# Altium project GanInverter.PrjPCB (part 2 of 3)

## Sheet Phase_Measurements.SchDoc
size A4; Author: K. Ilhan; CompanyName: Technische Hochschule Nürnberg Georg Simon Ohm; Organization: UltraZohm; Address1: Kesslerplatz 12; Address2: 90489 Nürnberg; Address3: GERMANY; SheetNumber: 6; SheetTotal: 8; Website: www.ultrazohm.com
Used 3 times, as channels PhaseMeasurements1, PhaseMeasurements2, PhaseMeasurements3. Parts and nets are listed once, with the designators drawn on the sheet.
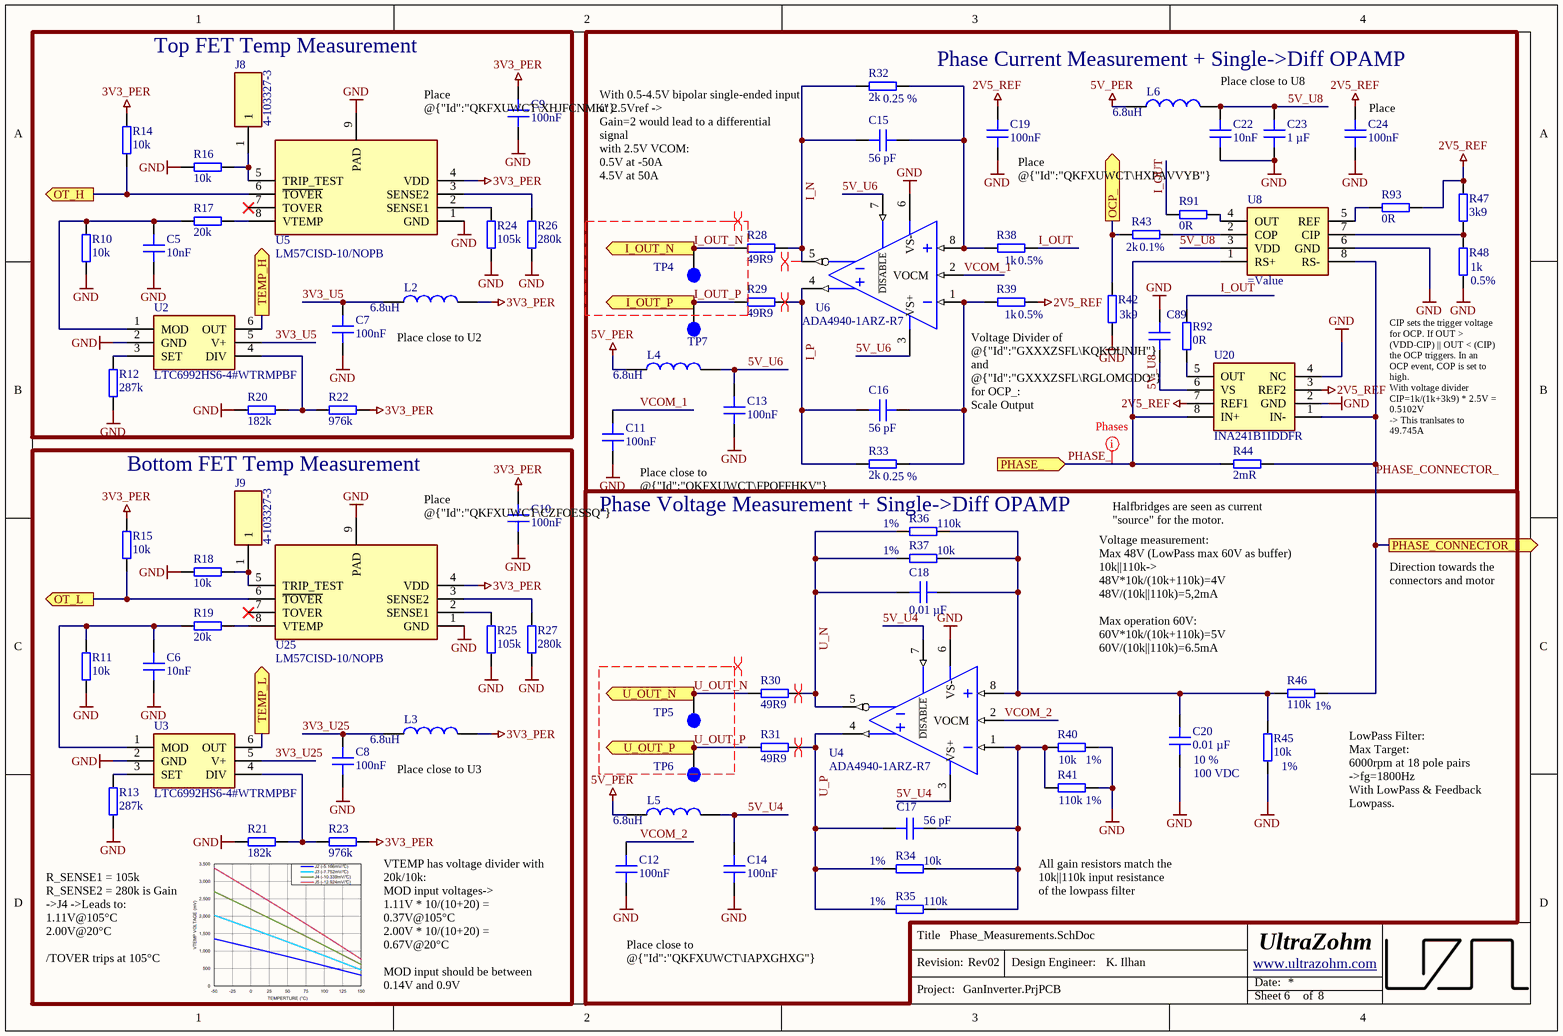
[diagram p4: Phase_Measurements.SchDoc]

### Parts
C5  10nF  [C_0603]
C6  10nF  [C_0603]
C7  100nF  [C_0603]
C8  100nF  [C_0603]
C9  100nF  [C_0603]
C10  100nF  [C_0603]
C11  100nF  [C_0603]
C12  100nF  [C_0603]
C13  100nF  [C_0603]
C14  100nF  [C_0603]
C15  56 pF  [C_0603]
C16  56 pF  [C_0603]
C17  56 pF  [C_0603]
C18  0.01 µF  [C_0603]
C19  100nF  [C_0603]
C20  0.01 µF  Tolerance: 10 %  Voltage Rating: 100 VDC  [C_0805]
C22  10nF  [C_0603]
C23  1 µF  [C_0603]
C24  100nF  [C_0603]
C89  100 nF  [C_0603]  (value not drawn)
J8  4-103327-3  [1_Pin_Header]
J9  4-103327-3  [1_Pin_Header]
L2  6.8uH  [INDC1608X95N]
L3  6.8uH  [INDC1608X95N]
L4  6.8uH  [INDC1608X95N]
L5  6.8uH  [INDC1608X95N]
L6  6.8uH  [INDC1608X95N]
R10  10k  [RES 0603_1608]
R11  10k  [RES 0603_1608]
R12  287k  [RES 0805_2012]
R13  287k  [RES 0805_2012]
R14  10k  [RES 0603_1608]
R15  10k  [RES 0603_1608]
R16  10k  [RES 0603_1608]
R17  20k  [RES 0603_1608]
R18  10k  [RES 0603_1608]
R19  20k  [RES 0603_1608]
R20  182k  [RES 0603_1608]
R21  182k  [RES 0603_1608]
R22  976k  [RES 0603_1608]
R23  976k  [RES 0603_1608]
R24  105k  [RES 0603_1608]
R25  105k  [RES 0603_1608]
R26  280k  [RES 0603_1608]
R27  280k  [RES 0603_1608]
R28  49R9  [RES 0603_1608]
R29  49R9  [RES 0603_1608]
R30  49R9  [RES 0603_1608]
R31  49R9  [RES 0603_1608]
R32  2k  Tolerance: 0.25 %  [RES 0603_1608]
R33  2k  Tolerance: 0.25 %  [RES 0603_1608]
R34  10k  Tolerance: 1%  [RES 0603_1608]
R35  110k  Tolerance: 1%  [RES 0603_1608]
R36  110k  Tolerance: 1%  [RES 0603_1608]
R37  10k  Tolerance: 1%  [RES 0603_1608]
R38  1k  Tolerance: 0.5%  [RES 0603_1608]
R39  1k  Tolerance: 0.5%  [RES 0603_1608]
R40  10k  Tolerance: 1%  [RES 0603_1608]
R41  110k  Tolerance: 1%  [RES 0603_1608]
R42  3k9  [RES 0603_1608]
R43  2k  Tolerance: 0.1%  [RES 0603_1608]
R44  2mR  [3921]
R45  10k  Tolerance: 1%  [RES 0603_1608]
R46  110k  Tolerance: 1%  [RES 0603_1608]
R47  3k9  [RES 0603_1608]
R48  1k  Tolerance: 0.5%  [RES 0603_1608]
R91  0R  [RES 0603_1608]
R92  0R  [RES 0603_1608]
R93  0R  [RES 0603_1608]
TP4  Testpoint 1mm  [TP_1mm]  (value not drawn)  (no BOM)
TP5  Testpoint 1mm  [TP_1mm]  (value not drawn)  (no BOM)
TP6  Testpoint 1mm  [TP_1mm]  (value not drawn)  (no BOM)
TP7  Testpoint 1mm  [TP_1mm]  (value not drawn)  (no BOM)
U2  LTC6992HS6-4#WTRMPBF  [SOT95P280X100-6N]
U3  LTC6992HS6-4#WTRMPBF  [SOT95P280X100-6N]
U4  ADA4940-1ARZ-R7  [SOT127P600X175-8N]
U5  LM57CISD-10/NOPB  [SON50P250X250X80-9N]
U6  ADA4940-1ARZ-R7  [SOT127P600X175-8N]
U8  (no value)  [SOP65P490X110-8N]
U20  INA241B1IDDFR  [SOT65P280X110-8N]
U25  LM57CISD-10/NOPB  [SON50P250X250X80-9N]

### Blocks framed on the sheet
Top FET Temp Measurement: C5 C7 C9 J8 L2 R10 R12 R14 R16 R17 R20 R22 R24 R26 U2 U5
Phase Current Measurement + Single->Diff OPAMP: C11 C13 C15 C16 C19 C22-C24 C89 L4 L6 R28 R29 R32 R33 R38 R39 R42-R44 R47 R48 R91-R93 TP4 TP7 U6 U8 U20
Bottom FET Temp Measurement: C6 C8 C10 J9 L3 R11 R13 R15 R18 R19 R21 R23 R25 R27 U3 U25
Phase Voltage Measurement + Single->Diff OPAMP: C12 C14 C17 C18 C20 L5 R30 R31 R34-R37 R40 R41 R45 R46 TP5 TP6 U4

### Ports
I_OUT_N (out), I_OUT_P (out), OCP_ (out), OT_H (out), OT_L (out), PHASE_ (in), PHASE_CONNECTOR_ (out), TEMP_H (out), TEMP_L (out), U_OUT_N (out), U_OUT_P (out)

### Nets
2V5_REF: C19.1 C24.1 R39.2 R47.2 R93.2 U20.3(REF2) U20.7(REF1)
3V3_PER: C9.1 C10.1 L2.2 L3.2 R14.1 R15.1 R22.2 R23.2 U5.4(VDD) U25.4(VDD)
5V_PER: L4.1 L5.1 L6.1
GND: C5.1 C6.1 C7.1 C8.1 C9.2 C10.2 C11.1 C12.1 C13.1 C14.1 C19.2 C20.1 C22.1 C23.1 C24.2 C89.1 R10.2 R11.2 R12.1 R13.1 R16.2 R18.2 R20.1 R21.1 R24.1 R25.1 R26.1 R27.1 R40.1 R41.2 R42.2 R45.1 R48.1 U2.2(GND) U3.2(GND) U4.6(VS-) U5.1(GND) U5.9(PAD) U6.6(VS-) U8.6(GND) U20.2(GND) U20.4(NC) U25.1(GND) U25.9(PAD)
3V3_U5: C7.2 L2.1 U2.5(V+)
3V3_U25: C8.2 L3.1 U3.5(V+)
5V_U4: C14.2 L5.2 U4.3(VS+) U4.7(~{DISABLE})
5V_U6: C13.2 L4.2 U6.3(VS+) U6.7(~{DISABLE})
5V_U8: C22.2 C23.2 C89.2 L6.2 U8.3(VDD) U20.6(VS)
I_N: C15.1 R28.2 R32.1 U6.5(VOUT-)
I_OUT: R38.2 R91.1 R92.2
I_OUT_N: R28.1 TP4.1 ; port I_OUT_N
I_OUT_P: R29.1 TP7.1 ; port I_OUT_P
I_P: C16.1 R29.2 R33.1 U6.4(VOUT+)
OCP_: R42.1 R43.1 ; port OCP_
OT_H: R14.2 U5.6(~{TOVER}) ; port OT_H
OT_L: R15.2 U25.6(~{TOVER}) ; port OT_L
PHASE_: R44.1 U8.1(RS+) U20.8(IN+) ; port PHASE_
PHASE_CONNECTOR_: R44.2 R46.2 U8.8(RS-) U20.1(IN-) ; port PHASE_CONNECTOR_
TEMP_H: U2.6(OUT) ; port TEMP_H
TEMP_L: U3.6(OUT) ; port TEMP_L
U_N: C18.1 R30.2 R36.1 R37.2 U4.5(VOUT-)
U_OUT_N: R30.1 TP5.1 ; port U_OUT_N
U_OUT_P: R31.1 TP6.1 ; port U_OUT_P
U_P: C17.1 R31.2 R34.2 R35.1 U4.4(VOUT+)
VCOM_1: C11.2 U6.2(VOCM)
VCOM_2: C12.2 U4.2(VOCM)
NetC5_2: C5.2 R10.1 R17.1 U2.1(MOD)
NetC6_2: C6.2 R11.1 R19.1 U3.1(MOD)
NetC15_2: C15.2 R32.2 R38.1 U6.8(VIN+)
NetC16_2: C16.2 R33.2 R39.1 U6.1(VIN-)
NetC17_2: C17.2 R34.1 R35.2 R40.2 R41.1 U4.1(VIN-)
NetC18_2: C18.2 C20.2 R36.2 R37.1 R45.2 R46.1 U4.8(VIN+)
NetJ8_1: J8.1 R16.1 U5.5(TRIP_TEST)
NetJ9_1: J9.1 R18.1 U25.5(TRIP_TEST)
NetR12_2: R12.2 U2.3(SET)
NetR13_2: R13.2 U3.3(SET)
NetR17_2: R17.2 U5.8(VTEMP)
NetR19_2: R19.2 U25.8(VTEMP)
NetR20_2: R20.2 R22.1 U2.4(DIV)
NetR21_2: R21.2 R23.1 U3.4(DIV)
NetR24_2: R24.2 U5.2(SENSE1)
NetR25_2: R25.2 U25.2(SENSE1)
NetR26_2: R26.2 U5.3(SENSE2)
NetR27_2: R27.2 U25.3(SENSE2)
NetR43_2: R43.2 U8.2(COP)
NetR47_1: R47.1 R48.2 U8.7(CIP)
NetR91_2: R91.2 U8.4(OUT)
NetR92_1: R92.1 U20.5(OUT)
NetR93_1: R93.1 U8.5(REF)

Not connected (* = marked no-connect by the designer): U5 7(TOVER)*; U25 7(TOVER)*

### Channels
PhaseMeasurements1: designators end in A; ports I_OUT_N=I_OUT_N I_OUT_P=I_OUT_P OCP_=OC_1 OT_H=OT_H1 OT_L=OT_L1 PHASE_=COM_HS PHASE_CONNECTOR_=PHASE_CONNECTOR_ TEMP_H=TEMP_H1 TEMP_L=TEMP_L1 U_OUT_N=U_OUT_N U_OUT_P=U_OUT_P
PhaseMeasurements2: designators end in B; ports I_OUT_N=I_OUT_N I_OUT_P=I_OUT_P OCP_=OC_2 OT_H=OT_H2 OT_L=OT_L2 PHASE_=COM_HS PHASE_CONNECTOR_=PHASE_CONNECTOR_ TEMP_H=TEMP_H2 TEMP_L=TEMP_L2 U_OUT_N=U_OUT_N U_OUT_P=U_OUT_P
PhaseMeasurements3: designators end in C; ports I_OUT_N=I_OUT_N I_OUT_P=I_OUT_P OCP_=OC_3 OT_H=OT_H3 OT_L=OT_L3 PHASE_=COM_HS PHASE_CONNECTOR_=PHASE_CONNECTOR_ TEMP_H=TEMP_H3 TEMP_L=TEMP_L3 U_OUT_N=U_OUT_N U_OUT_P=U_OUT_P

### Layout directives
differential pair: I_N_PhaseMeasurements1, I_OUT_N, I_OUT_P, I_P_PhaseMeasurements1, U_N_PhaseMeasurements1, U_OUT_N, U_OUT_P, U_P_PhaseMeasurements1
net class Power: COM_HS

### Notes on the sheet
- Place @{"Id":"QKFXUWCT\XHJFCNMK"} close to U5
- Place close to U8
- (near C24) Place @{"Id":"QKFXUWCT\MQDZIENV"} close to U8
- With 0.5-4.5V bipolar single-ended input at 2.5Vref ->
  Gain=2 would lead to a differential signal
  with 2.5V VCOM:
  0.5V at -50A
  4.5V at 50A
- (near C19) Place @{"Id":"QKFXUWCT\HXPAVVYB"} close to @{"Id":"QKFXUWCT\EZPYTFWS"}
- (near L2) Place close to U2
- Voltage Divider of @{"Id":"GXXXZSFL\KQKOUNJH"} and @{"Id":"GXXXZSFL\RGLOMGDO"} for OCP_:
  Scale Output
  5V -> 3V3
  (5V*3k9)/3k9+2k)
  -> 3.31V
- Place @{"Id":"QKFXUWCT\CZFOESSQ"} close to @{"Id":"QKFXUWCT\SWIXKLSF"}
- Place close to @{"Id":"QKFXUWCT\FPQFFHKV"} OPAMP
- (near R44) Halfbridges are seen as current "source" for the motor.
- (near R48) CIP sets the trigger voltage for OCP. If OUT > (VDD-CIP) || OUT < (CIP) the OCP triggers. In an OCP event, COP is set to high.
  With voltage divider CIP=1k/(1k+3k9) * 2.5V = 0.5102V
  -> This tranlsates to 49.745A
- (near R46) Voltage measurement:
  Max 48V (LowPass max 60V as buffer)
  10k||110k->
  48V*10k/(10k+110k)=4V
  48V/(10k||110k)=5,2mA
  Max operation 60V:
  60V*10k/(10k+110k)=5V
  60V/(10k||110k)=6.5mA
- Direction towards the connectors and motor
- (near L3) Place close to U3
- (near R46) LowPass Filter:
  Max Target:
  6000rpm at 18 pole pairs
  ->fg=1800Hz
  With LowPass & Feedback Lowpass.
- All gain resistors match the 10k||110k input resistance of the lowpass filter
- R_SENSE1 = 105k
  R_SENSE2 = 280k is Gain
  ->J4 ->Leads to:
  1.11V@105°C
  2.00V@20°C
  /TOVER trips at 105°C
- (near R23) VTEMP has voltage divider with 20k/10k:
  MOD input voltages->
  1.11V * 10/(10+20) = 0.37V@105°C
  2.00V * 10/(10+20) = 0.67V@20°C
  MOD input should be between 0.14V and 0.9V
- Place close to @{"Id":"QKFXUWCT\IAPXGHXG"} OPAMP
- Title
- Revision:
- Design Engineer:
- Date:
- Project:
- Sheet
- of

### Library data of the parts
C5 C6 C22 = CT41G-0603-2X1-50V-0.01μF-K(N): 50V 10nF 2X1 ±10%; Manufacturer: TORCH; Voltage Rating: 50 VDC; Created from: KIlhan; Manufacturer Part Number: CT41G-0603-2X1-50V-0.01μF-K(N); PartID: 130; Created On: 7/5/2023 6:57:50 PM; ComponentLink1Description: Datasheet; ComponentLink1URL: https://datasheet.lcsc.com/lcsc/1809291621_TORCH-CT41G-0603-2X1-50V-0-01-F-K-N_C136131.pdf; Component Type: Capacitor 0603; Device Package: 0603; Last Updated: 7/5/2023 6:57:50 PM; Mounting Type: SMD; Operating Temperature: -55 - 125°C; Supplier 1: LCSC; Supplier Part Number 1: C136131; Type: Capacitor; Tolerance: 10 %; Value: 10nF; Live Cycle Status: 1; Stock number: not stored; LCSC Part Number: C136131
C7-C14 C19 C24 = CGA3E3X8R1H104KT0Y0N: 50V 100nF X8R ±10% 0603; Manufacturer: TDK; Voltage Rating: 50 VDC; Created from: KIlhan; Manufacturer Part Number: CGA3E3X8R1H104KT0Y0N; PartID: 131; Created On: 7/5/2023 7:32:58 PM; ComponentLink1Description: Datasheet; ComponentLink1URL: https://datasheet.lcsc.com/lcsc/2304140030_TDK-CGA3E3X8R1H104KT0Y0N_C342825.pdf; Component Type: Capacitor 0603; Device Package: 0603; Last Updated: 7/5/2023 7:32:58 PM; Mounting Type: SMD; Operating Temperature: -55 - 125°C; Series: CGA; Supplier 1: LCSC; Supplier Part Number 1: C342825; Type: Capacitor; Tolerance: 10 %; Value: 100nF; Live Cycle Status: 1; Stock number: not stored; LCSC Part Number: C342825
C15-C17 = CL10C560JB8NNNC: Capacitor 0603, 50 VDC, 56 pF, C0G; Manufacturer: Samsung Electro-Mechanics; Tolerance: 5 %; Voltage Rating: 50 VDC; Created from: DHufnagel; Manufacturer Part Number: CL10C560JB8NNNC; PartID: 92; Created On: 12/20/2020 1:54:13 PM; ComponentLink1Description: Datasheet; ComponentLink1URL: https://www.mouser.de/datasheet/2/585/MLCC-1837944.pdf; Component Type: Capacitor 0603; Device Package: 0603; Last Updated: 12/20/2020 4:24:16 PM; Mounting Type: SMD; Operating Temperature: -55 - 125°C; Series: CL; Supplier 1: Mouser; Supplier Part Number 1: 187-CL10C560JB8NNNC; Supplier 2: LCSC; Supplier Part Number 2: C39148; Type: Capacitor; Value: 56 pF; Live Cycle Status: 1; LCSC Part Number: C39148; Stock number: not stored
C18 = C1608C0G1E103JT000N: 25V 10nF C0G ±5% 0603 Multilayer Ceramic Capacitors MLCC - SMD/SMT ROHS; Manufacturer: TDK; Voltage Rating: 25 VDC; Created from: KIlhan; Manufacturer Part Number: C1608C0G1E103JT000N; PartID: 127; Created On: 7/5/2023 3:26:52 PM; ComponentLink1Description: Datasheet; ComponentLink1URL: https://product.tdk.com/system/files/dam/doc/product/capacitor/ceramic/mlcc/catalog/mlcc_commercial_general_en.pdf; Component Type: Capacitor 0603; Device Package: 0603; Last Updated: 7/5/2023 3:26:52 PM; Mounting Type: SMD; Operating Temperature: -55 - 125°C; Series: C; Supplier 1: Mouser; Supplier Part Number 1: 810-C1608C0G1E103J; Type: Capacitor; Tolerance: 5 %; Value: 0.01 µF; Live Cycle Status: 1; Stock number: not stored; LCSC Part Number: C343007
C20 = HV0805X7R103K101NT: 100V 10nF 0805 Multilayer Ceramic Capacitors MLCC - SMD/SMT ROHS; Manufacturer: AIDE; Created from: KIlhan; Manufacturer Part Number: HV0805X7R103K101NT; PartID: 128; Created On: 7/5/2023 3:42:28 PM; ComponentLink1Description: Datasheet; ComponentLink1URL: https://datasheet.lcsc.com/lcsc/2103311437_AIDE-HV1210X7R332K202NT_C2691813.pdf; Component Type: Capacitor 0805; Device Package: 0805; Last Updated: 7/5/2023 3:42:28 PM; Mounting Type: SMD; Operating Temperature: -55 - 125°C; Series: C; Supplier 1: JLCPCB; Supplier Part Number 1: HV0805X7R103K101NT; Type: Capacitor; Value: 0.01 µF; Live Cycle Status: 1; Stock number: not stored; LCSC Part Number: C2691724
C23 = UMK107AB7105KA-T: 50V 1uF X7R ±10% 0603 Multilayer Ceramic Capacitors MLCC - SMD/SMT ROHS; Manufacturer: Taiyo Yuden; Voltage Rating: 50 VDC; Created from: NDiringer; Manufacturer Part Number: UMK107AB7105KA-T; PartID: 98; Created On: 8/9/2022 9:35:02 AM; ComponentLink1Description: Datasheet; ComponentLink1URL: https://www.mouser.de/datasheet/2/396/mlcc02_e-1307760.pdf; Component Type: Capacitor 0603; Device Package: 0603; Last Updated: 9/21/2022 4:11:37 PM; Mounting Type: SMD; Operating Temperature: -55 - 125°C; Series: X7R; Type: Capacitor; Tolerance: 10 %; Value: 1 µF; Live Cycle Status: 1; Stock number: not stored; LCSC Part Number: C105174; Supplier 1: LCSC; Supplier Part Number 1: C105174; Supplier 2: Mouser; Supplier Part Number 2: 963-UMK107AB7105MA-T
C89 = CC0603KRX7R9BB104: Capacitor 0603, 50 VDC, 100 nF, X7R; Manufacturer: YAGEO; Tolerance: 10 %; Voltage Rating: 50 VDC; Created from: AGeiger; Manufacturer Part Number: CC0603KRX7R9BB104; PartID: 102; Created On: 8/22/2022 2:35:53 PM; ComponentLink1Description: Datasheet; ComponentLink1URL: https://datasheet.lcsc.com/lcsc/1809301912_YAGEO-CC0603KRX7R9BB104_C14663.pdf; Component Type: Capacitor 0603; Device Package: 0603; Last Updated: 8/22/2022 2:35:53 PM; Mounting Type: SMD; Operating Temperature: -55 - 125°C; Series: X7R; Supplier 1: LCSC; Supplier Part Number 1: C14663; Type: Capacitor; Value: 100 nF; Live Cycle Status: 1; Supplier 2: Mouser; Supplier Part Number 2: 603-CC603KRX7R9BB104; LCSC Part Number: C14663
J8 J9 = 4-103327-3: Pin Header, 2.54mm, 1 Pin; Manufacturer: TE Connectivity; Created from: DHufnagel; Number of positions: 1; Manufacturer Part Number: 4-103327-3; PartID: 12; Created On: 8/18/2022 9:37:37 AM; ComponentLink1Description: Datasheet; ComponentLink1URL: https://www.mouser.de/datasheet/2/418/NG_CD_103327_T_baseFilename-749242.pdf; Component Type: Pin Header; Device Package: THT; Last Updated: 6/16/2023 12:29:10 PM; Mounting Type: THT; Operating Temperature: -65 - 105 °C; Series: AMPMODU MOD II; Supplier 1: Mouser; Supplier Part Number 1: 571-4-103327-3; Type: Pin Header; Live Cycle Status: 1; LCSC Part Number: C3347196; Stock number: not stored; Number of rows: 1
L2-L6 = CMCW1608F6R8KTT: 6.8uH ±10% 0603 Inductors (SMD) ROHS; Manufacturer: Cybermax; MF: EPCOS / TDK; DCR: 320m; Rated Current: 0.85 A; Type: fixed inductor; DC current: 15mA; Created from: KIlhan; MPN: B82464G4154M; Supplier 1: LCSC; Supplier Part Number 1: C961362; Value: 6.8uH; Manufacturer Part Number: CMCW1608F6R8KTT; PartID: 17; Created On: 7/5/2023 8:42:04 PM; ComponentLink1Description: Datasheet; ComponentLink1URL: https://jlcpcb.com/partdetail/Cybermax-CMCW1608F6R8KTT/C961362; Component Type: SMD fixed inductor; Device Package: SMD; Last Updated: 7/5/2023 8:42:04 PM; Mounting Type: SMD; Operating Temperature: -40 - 85 °C; Live Cycle Status: 1; Stock number: C961362; LCSC Part Number: C961362
R10 R11 R14-R16 R18 = RK73B1JTTD103J: SMD resistor E24 series; Manufacturer: KOA Speer; Tolerance: 5%; Created from: MGremer; Manufacturer Part Number: RK73B1JTTD103J; PartID: 98; Created On: 12/14/2020 4:17:14 PM; ComponentLink1Description: Datasheet; ComponentLink1URL: https://www.mouser.de/datasheet/2/219/RK73B-1825463.pdf; Component Type: SMD resistor; Device Package: 0603; Last Updated: 5/27/2022 2:04:22 PM; Mounting Type: SMD; Supplier 1: Mouser; Supplier Part Number 1: 660-RK73B1JTTD103J; Type: Resistor; Value: 10k; Live Cycle Status: 1; Stock number: Labor SMD Container; LCSC Part Number: C25804
R12 R13 = ERJ-6ENF2873V: SMD resistor 1%; Manufacturer: Panasonic; Created from: MGremer; Manufacturer Part Number: ERJ-6ENF2873V; PartID: 154; Created On: 12/14/2020 4:17:14 PM; ComponentLink1Description: Datasheet; ComponentLink1URL: https://www.mouser.de/datasheet/2/315/AOA0000C304-1149620.pdf; Component Type: SMD resistor; Device Package: 0805; Last Updated: 2/15/2023 6:07:29 PM; Mounting Type: SMD; Supplier 1: Mouser; Supplier Part Number 1: 667-ERJ-6ENF2873V; Type: Resistor; Tolerance: 1%; Value: 287k; Live Cycle Status: 1; Stock number: not stored; LCSC Part Number: C228683
R17 R19 = 0603WAF2002T5E: SMD resistor E24 series; Manufacturer: UNI-ROYAL; Tolerance: 1%; Created from: AGeiger; Manufacturer Part Number: 0603WAF2002T5E; PartID: 105; Created On: 12/14/2020 4:17:14 PM; ComponentLink1Description: Datasheet; ComponentLink1URL: https://datasheet.lcsc.com/lcsc/2206010230_UNI-ROYAL-Uniroyal-Elec-0603WAF2002T5E_C4184.pdf; Component Type: SMD resistor; Device Package: 0603; Last Updated: 8/25/2022 8:05:50 PM; Mounting Type: SMD; Supplier 1: LCSC; Supplier Part Number 1: C4184; Type: Resistor; Value: 20k; Live Cycle Status: 1; Stock number: Labor SMD Container; LCSC Part Number: C4184
R20 R21 = CR0603-FX-1823ELF: SMD resistor 1%, 50V, 100ppm; Manufacturer: Bourns; Created from: DHufnagel; Manufacturer Part Number: CR0603-FX-1823ELF; PartID: 235; Created On: 7/25/2022 8:26:35 AM; ComponentLink1Description: Datasheet; ComponentLink1URL: https://www.mouser.de/datasheet/2/54/cr-1858361.pdf; Component Type: SMD resistor; Device Package: 0603; Last Updated: 2/15/2023 6:09:14 PM; Mounting Type: SMD; Supplier 1: Mouser; Supplier Part Number 1: 652-CR0603FX-1823ELF; Type: Resistor; Tolerance: 1%; Value: 182k; Live Cycle Status: 1; Stock number: not stored; LCSC Part Number: C203368
R22 R23 = CR0603-FX-9763ELF: SMD resistor 1%, 50V, 100ppm; Manufacturer: Bourns; Created from: DHufnagel; Manufacturer Part Number: CR0603-FX-9763ELF; PartID: 234; Created On: 7/25/2022 8:26:35 AM; ComponentLink1Description: Datasheet; ComponentLink1URL: https://www.mouser.de/datasheet/2/54/cr-1858361.pdf; Component Type: SMD resistor; Device Package: 0603; Last Updated: 2/15/2023 6:14:05 PM; Mounting Type: SMD; Supplier 1: Mouser; Supplier Part Number 1: 652-CR0603FX-9763ELF; Type: Resistor; Tolerance: 1%; Value: 976k; Live Cycle Status: 1; Stock number: not stored; LCSC Part Number: C162980
R24 R25 = RC0603FR-07105KL: 100mW Thick Film Resistors ±100ppm/℃ ±1% 105kΩ 0603 Chip Resistor - Surface Mount ROHS; Manufacturer: YAGEO; Created from: KIlhan; Manufacturer Part Number: RC0603FR-07105KL; PartID: 280; Created On: 7/5/2023 6:19:43 PM; ComponentLink1Description: Datasheet; ComponentLink1URL: https://jlcpcb.com/partdetail/Yageo-RC0603FR07105KL/C141685; Component Type: SMD resistor; Device Package: 0603; Last Updated: 7/5/2023 6:19:43 PM; Mounting Type: SMD; Supplier 1: LCSC; Supplier Part Number 1: C141685; Type: Resistor; Tolerance: 1%; Value: 105k; Live Cycle Status: 1; Stock number: not stored; LCSC Part Number: C141685
R26 R27 = RT0603BRE07280KL: 100mW Thin Film Resistor ±50ppm/℃ ±0.1% 280kΩ 0603 Chip Resistor - Surface Mount ROHS; Manufacturer: YAGEO; Created from: KIlhan; Manufacturer Part Number: RT0603BRE07280KL; PartID: 281; Created On: 7/5/2023 6:25:27 PM; ComponentLink1Description: Datasheet; ComponentLink1URL: https://jlcpcb.com/partdetail/Yageo-RT0603BRE07280KL/C861797; Component Type: SMD resistor; Device Package: 0603; Last Updated: 7/5/2023 6:25:27 PM; Mounting Type: SMD; Supplier 1: LCSC; Supplier Part Number 1: C861797; Type: Resistor; Tolerance: 0.1%; Value: 280k; Live Cycle Status: 1; Stock number: not stored; LCSC Part Number: C861797
R28-R31 = TNPW060349R9BEEA: 125mW Thin Film Resistor ±0.1% ±25ppm/℃ 49.9Ω 0603; Manufacturer: Vishay Intertech; Created from: KIlhan; Manufacturer Part Number: TNPW060349R9BEEA; PartID: 286; Created On: 7/5/2023 8:32:44 PM; ComponentLink1Description: Datasheet; ComponentLink1URL: https://www.vishay.com/docs/28758/tnpw_e3.pdf; Component Type: SMD resistor; Device Package: 0603; Last Updated: 7/5/2023 8:32:44 PM; Mounting Type: SMD; Supplier 1: Mouser; Supplier Part Number 1: 71-TNPW060349R9BEEA; Type: Resistor; Tolerance: 0.1%; Value: 49R9; Live Cycle Status: 1; Stock number: not stored; LCSC Part Number: C2075693
R32 R33 = RT0603CRE072KL: 100mW Thin Film Resistor ±50ppm/℃ ±0.25% 2kΩ 0603 Chip Resistor - Surface Mount ROHS; Manufacturer: YAGEO; Created from: KIlhan; Manufacturer Part Number: RT0603CRE072KL; PartID: 287; Created On: 7/5/2023 10:38:54 PM; ComponentLink1Description: Datasheet; ComponentLink1URL: https://www.mouser.de/datasheet/2/447/PYu_RT_1_to_0_01_RoHS_L_12-3003070.pdf; Component Type: SMD resistor; Device Package: 0603; Last Updated: 7/5/2023 10:38:54 PM; Mounting Type: SMD; Supplier 1: Mouser; Supplier Part Number 1: RT0603CRE072KL; Type: Resistor; Value: 2k; Live Cycle Status: 1; Stock number: not stored; LCSC Part Number: C705921
R34 R37 R40 R45 = 0603WAF1002T5E: SMD resistor 1%; Manufacturer: UNI-ROYAL; Created from: AGeiger; Manufacturer Part Number: 0603WAF1002T5E; PartID: 265; Created On: 6/1/2023 6:49:29 AM; ComponentLink1Description: Datasheet; ComponentLink1URL: https://datasheet.lcsc.com/lcsc/2206010045_UNI-ROYAL-Uniroyal-Elec-0603WAF1002T5E_C25804.pdf; Component Type: SMD resistor; Device Package: 0603; Last Updated: 6/1/2023 6:49:29 AM; Mounting Type: SMD; Supplier 1: LCSC; Supplier Part Number 1: C25804; Type: Resistor; Value: 10k; Live Cycle Status: 1; LCSC Part Number: C25804
R35 R36 R41 R46 = WR06X1103FTL: 100mW Thick Film Resistors ±100ppm/℃ ±1% 110kΩ 0603 Chip Resistor - Surface Mount ROHS; Manufacturer: Walsin Tech Corp; Created from: KIlhan; Manufacturer Part Number: WR06X1103FTL; PartID: 282; Created On: 7/5/2023 6:31:24 PM; ComponentLink1Description: Datasheet; ComponentLink1URL: https://jlcpcb.com/partdetail/Walsin_TechCorp-WR06X1103FTL/C168275; Component Type: SMD resistor; Device Package: 0603; Last Updated: 7/5/2023 6:31:24 PM; Mounting Type: SMD; Supplier 1: LCSC; Supplier Part Number 1: C168275; Type: Resistor; Value: 110k; Live Cycle Status: 1; Stock number: not stored; LCSC Part Number: C168275
R38 R39 R48 = 0603WAD1001T5E: SMD resistor E24 series 470 kOhms 100-200 mW 0603 1%; Manufacturer: UNI-ROYAL(Uniroyal Elec); Created from: NDiringer; Manufacturer Part Number: 0603WAD1001T5E; PartID: 261; Created On: 3/17/2023 3:28:58 PM; ComponentLink1Description: Datasheet; ComponentLink1URL: https://jlcpcb.com/partdetail/396162-0603WAD2702T5E/C407605; Component Type: SMD resistor; Device Package: 0603; Last Updated: 3/17/2023 3:28:58 PM; Mounting Type: SMD; Supplier 1: LCSC/JLCPCB; Supplier Part Number 1: C51218; Type: Resistor; Value: 1k; Live Cycle Status: 1; Stock number: not stored; LCSC Part Number: C51218
R42 R47 = RT0603FRE073K9L: SMD resistor E24 series; Manufacturer: YAGEO; Tolerance: 1%; Created from: DHufnagel; Manufacturer Part Number: RT0603FRE073K9L; PartID: 250; Created On: 12/14/2020 4:17:14 PM; ComponentLink1Description: Datasheet; ComponentLink1URL: https://www.mouser.de/datasheet/2/447/PYu_RT_1_to_0_01_RoHS_L_12-3003070.pdf; Component Type: SMD resistor; Device Package: 0603; Last Updated: 7/5/2023 6:34:06 PM; Mounting Type: SMD; Supplier 1: Mouser; Supplier Part Number 1: 603-RT0603FRE073K9L; Type: Resistor; Value: 3k9; Live Cycle Status: 1; Stock number: not stored; LCSC Part Number: C863790
R43 = ERJ-PB3B2001V: SMD resistor 0.1%; Manufacturer: Panasonic; Created from: DHufnagel; Manufacturer Part Number: ERJ-PB3B2001V; PartID: 215; Created On: 12/14/2020 4:17:14 PM; ComponentLink1Description: Datasheet; ComponentLink1URL: https://www.mouser.de/datasheet/2/315/AOA0000C328-1530132.pdf; Component Type: SMD resistor; Device Package: 0603; Last Updated: 3/2/2021 2:07:32 PM; Mounting Type: SMD; Supplier 1: Mouser; Supplier Part Number 1: 667-ERJ-PB3B2001V; Supplier 2: LCSC; Supplier Part Number 2: C189729; Type: Resistor; Value: 2k; Live Cycle Status: 1; Stock number: not stored; LCSC Part Number: C189729
R44 = PU3921FKMP50R002L: Shunt resistor 2mOhm, 5W, 1%; Manufacturer: YAGEO; Created from: DHufnagel; Manufacturer Part Number: PU3921FKMP50R002L; PartID: 236; Created On: 7/12/2022 7:38:48 AM; ComponentLink1Description: Datasheet; ComponentLink1URL: https://www.mouser.de/datasheet/2/447/PYu_PU_51_RoHS_L_8-3003083.pdf; Component Type: Shunt SMD resistor; Device Package: 3921; Last Updated: 6/16/2023 12:23:12 PM; Mounting Type: SMD; Supplier 1: Mouser; Supplier Part Number 1: 603-PU3921FKMP50R002; Type: Shunt; Tolerance: 1%; Value: 2mR; Live Cycle Status: 1; Stock number: not stored; LCSC Part Number: C2090244
R91-R93 = RC0603JR-070RL: SMD resistor E24 series; Manufacturer: YAGEO; Tolerance: 5%; Created from: MGremer; Manufacturer Part Number: RC0603JR-070RL; PartID: 1; Created On: 12/14/2020 4:17:14 PM; ComponentLink1Description: Datasheet; ComponentLink1URL: https://www.mouser.de/datasheet/2/447/PYu-RC_Group_51_RoHS_L_10-1664068.pdf; Component Type: SMD resistor; Device Package: 0603; Last Updated: 3/4/2021 9:09:42 AM; Mounting Type: SMD; Supplier 1: Mouser; Supplier Part Number 1: 603-RC0603JR-070RL; Type: Resistor; Value: 0R; Live Cycle Status: 1; Stock number: Labor SMD Container; LCSC Part Number: C21189; Supplier 2: LCSC; Supplier Part Number 2: C21189
TP4-TP7 = NULL: Manufacturer Part Number: NULL; Created from: AGeiger; Created: 2018_06_25_AGeiger; Value: Testpoint 1mm; PartID: 9; Created On: 9/20/2022 1:14:57 PM; Component Type: Testpoint; Last Updated: 9/20/2022 1:15:39 PM; Manufacturer: NULL; Supplier 1: NULL; Supplier Part Number 1: NULL; Type: Testpoint; Live Cycle Status: 1
U2 U3 = LTC6992HS6-4#WTRMPBF: Switching Controllers PWM with 5% to 100% Pulse Width Control; Manufacturer: Analog Devices; Created from: DHufnagel; Manufacturer Part Number: LTC6992HS6-4#WTRMPBF; PartID: 9; Created On: 7/20/2022 2:30:26 PM; ComponentLink1Description: Datasheet; ComponentLink1URL: https://www.mouser.de/datasheet/2/609/LTC6992-1-6992-2-6992-3-6992-4-1852873.pdf; Component Type: Switching Controllers; Device Package: SOT-23-6; Last Updated: 6/14/2023 10:16:01 PM; Mounting Type: SMD; Operating Temperature: -40 - 125°C; Supplier 1: Mouser; Supplier Part Number 1: 584-6992HS64WTRMPBF; Type: Switching Controller; Live Cycle Status: 1; LCSC Part Number: C3304518; Stock number: not stored
U4 U6 = ADA4940-1ARZ-R7: Fully Differential Amplifier, Ultralow-Power,Low Distortion, 260-MHz; Manufacturer: Analog Devices; Channels: 1; GBP: 260 MHz; CMRR: 86 dB; Created from: DHufnagel; Manufacturer Part Number: ADA4940-1ARZ-R7; PartID: 14; Created On: 8/18/2022 12:53:27 PM; ComponentLink1Description: Datasheet; ComponentLink1URL: https://www.mouser.de/datasheet/2/609/ada4940_1_4940_2-2955874.pdf; Component Type: Differential Amplifier; Device Package: SOIC-8; Last Updated: 8/18/2022 1:04:18 PM; Mounting Type: SMD; Operating Temperature: -40 - 105°C; Series: ADA4940-1; Supplier 1: Mouser; Supplier Part Number 1: 584-ADA4940-1ARZ; Supplier 2: Digi-Key; Supplier Part Number 2: 505-ADA4940-1ARZ-ND; Supplier 3: LCSC; Supplier Part Number 3: C730049; Type: Differential Amplifiers; Live Cycle Status: 1; LCSC Part Number: C730049; Stock number: not stored
U5 U25 = LM57CISD-10/NOPB: Board Mount Temperature Sensor, -50 - 150°C; Manufacturer: Texas Instruments; Created from: DHufnagel; Manufacturer Part Number: LM57CISD-10/NOPB; PartID: 5; Created On: 6/30/2022 8:21:10 AM; ComponentLink1Description: Datasheet; ComponentLink1URL: https://www.ti.com/general/docs/suppproductinfo.tsp?distId=26&gotoUrl=https://www.ti.com/lit/gpn/lm57; Component Type: Temperature Sensors; Device Package: WSON-8; Last Updated: 6/14/2023 10:16:01 PM; Mounting Type: SMD; Operating Temperature: -50 - 150°C; Supplier 1: Mouser; Supplier Part Number 1: 926-LM57CISD-10/NOPB; Supplier 2: Digi-Key; Supplier Part Number 2: LM57CISD-10/NOPBCT-ND; Type: Temperature Sensor; Live Cycle Status: 1; LCSC Part Number: C2864091; Stock number: not stored
U8 = MAX40056TAUA+T: Current Sense Amplifier, 300kHz, -0.1V to 65V CMV, 2 Channel; Manufacturer_Name: Maxim Integrated; Channels: 2; CMRR: 140dB; Created from: KIlhan; Datasheet Link: https://pdfserv.maximintegrated.com/en/ds/MAX40056F-MAX40056U.pdf; Height: 1.1mm; Manufacturer_Part_Number: MAX40056TAUA+; Mouser Part Number: 700-MAX40056TAUA+; Mouser Price/Stock: https://www.mouser.co.uk/ProductDetail/Maxim-Integrated/MAX40056TAUA%2b?qs=wnTfsH77Xs6U0RpBmDIzAw%3D%3D; Arrow Part Number: MAX40056TAUA+; Arrow Price/Stock: https://www.arrow.com/en/products/max40056taua/maxim-integrated?region=nac; Manufacturer Part Number: MAX40056TAUA+T; PartID: 21; Created On: 7/5/2023 11:17:18 PM; ComponentLink1Description: Datasheet; ComponentLink1URL: https://datasheets.maximintegrated.com/en/ds/MAX40056F-MAX40056U.pdf; Component Type: Operational Amplifier; Device Package: uMAX-8; Last Updated: 7/5/2023 11:17:18 PM; Manufacturer: Maxim Integrated; Mounting Type: SMD; Operating Temperature: -40 to +125°C; Series: MAX40056; Supplier 1: Mouser; Supplier Part Number 1: 700-MAX40056TAUA+T; Type: Current Sense Amplifier; GBP: 300 kHz; Live Cycle Status: 1; LCSC Part Number: C4550714; Stock number: not stored
U20 = INA241B1IDDFR: Current Sense Amplifiers -5-V to 110-V bidirectional high-precision current sense amplifier with enhanced PWM rejection; Manufacturer_Name: Texas Instruments; Channels: 1; CMRR: 120 dB; Created from: KIlhan; GBP: 1.1 MHz; Datasheet Link: https://www.ti.com/general/docs/suppproductinfo.tsp?distId=26&gotoUrl=https://www.ti.com/lit/gpn/ina241a; Height: 1.1mm; Manufacturer_Part_Number: INA241B1IDDFR; Mouser Part Number: 595-INA241B1IDDFR; Mouser Price/Stock: https://www.mouser.de/ProductDetail/Texas-Instruments/INA241B1IDDFR?qs=IPgv5n7u5Qb8VGovuCsC%2FQ%3D%3D; Arrow Part Number: INA241B1IDDFR; Arrow Price/Stock: https://www.arrow.com/en/products/ina241b1iddfr/texas-instruments?q=INA241B1IDDFR; Manufacturer Part Number: INA241B1IDDFR; ComponentLink1Description: Datasheet; ComponentLink1URL: https://www.ti.com/lit/ds/symlink/ina241a.pdf?HQS=dis-mous-null-mousermode-dsf-pf-null-wwe&ts=1687715365898&ref_url=https%253A%252F%252Fwww.mouser.de%252F; Component Type: Operational Amplifier; Created On: 6/25/2023 7:15:05 PM; Last Updated: 7/11/2023 4:11:28 PM; LCSC Part Number: C7433256; Live Cycle Status: 1; Manufacturer: Texas Instruments; Mounting Type: SMD; Operating Temperature: -40 to +125°C; PartID: 20; Series: INA241B; Stock number: not stored; Supplier 1: Mouser; Supplier Part Number 1: 595-INA241B1IDDFR; Type: Current Sense Amplifier